# EAGLE schematic ESP8266 (EAGLE 9.5.2)
COMPANY: ADAFRUIT INDUSTRIES; DRAWN: KTOWN; REV: B
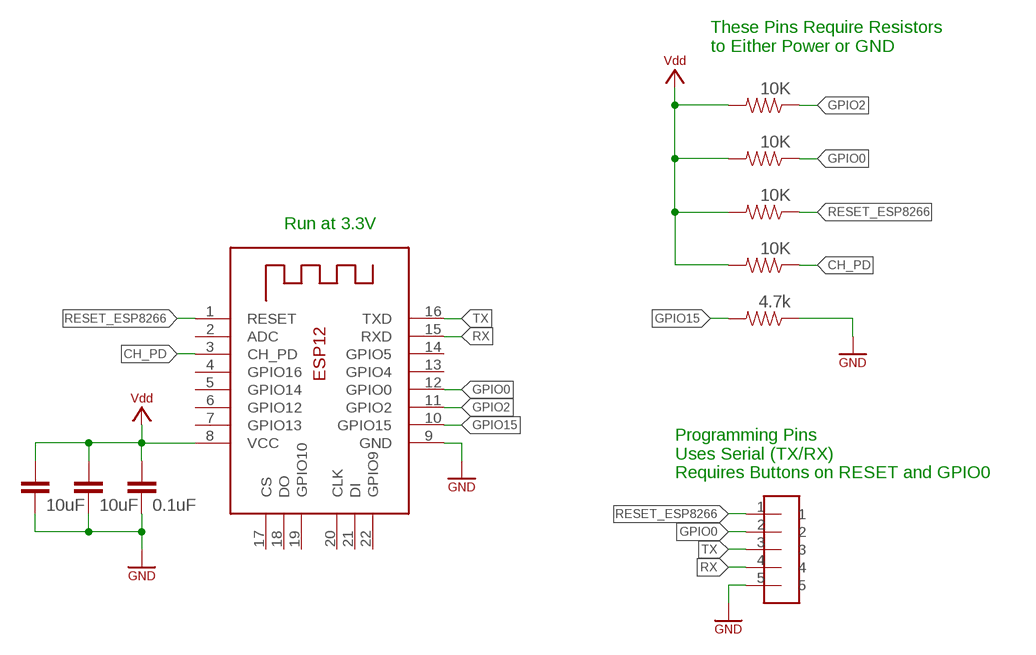
[diagram p0: schematic, sheet 1]

## Parts
C1  0.1uF  COMPONENT_CAP-0805  [0805]
C2  10uF  COMPONENT_CAP-0805  [0805]
C3  10uF  COMPONENT_CAP-0805  [0805]
R1  10K  COMPONENT_RESISTOR-0805  [0805]
R2  10K  COMPONENT_RESISTOR-0805  [0805]
R3  10K  COMPONENT_RESISTOR-0805  [0805]
R4  10K  COMPONENT_RESISTOR-0805  [0805]
R5  4.7k  COMPONENT_RESISTOR-0805  [0805]
U$1  HEADER-5-TESTPOINT  [TESTPOINT-5]
X1  MICRO_ESP8266  [ESP-12E]

## Nets
CH_PD: R4.1 X1.3(CH_PD)
GND: C1.2 C2.2 C3.2 R5.1 U$1.5 X1.9(GND) ; supply symbol labelled SYMBOL_GND
GPIO0: R2.1 U$1.2 X1.12(GPIO0)
GPIO2: R1.1 X1.11(GPIO2)
GPIO15: R5.2 X1.10(GPIO15)
RESET_ESP8266: R3.1 U$1.1 X1.1(RESET)
RX: U$1.4 X1.15(RXD)
TX: U$1.3 X1.16(TXD)
VDD: C1.1 C2.1 C3.1 R1.2 R2.2 R3.2 R4.2 X1.8(VCC) ; supply symbol labelled SYMBOL_VDD
Unconnected: X1.2(ADC) X1.4(GPIO16) X1.5(GPIO14) X1.6(GPIO12) X1.7(GPIO13) X1.13(GPIO4) X1.14(GPIO5) X1.17(CS) X1.18(DO) X1.19(GPIO10) X1.20(CLK) X1.21(DI) X1.22(GPIO9)

## Notes on the sheet
- These Pins Require Resistors
  to Either Power or GND
- Run at 3.3V
- Programming Pins
  Uses Serial (TX/RX)
  Requires Buttons on RESET and GPIO0

## Library data of the parts
C1-C3 = homemade-hardware:COMPONENT_CAP: Capacitor Standard 0603 ceramic capacitor, and 0.1" leaded capacitor.
R1-R5 = homemade-hardware:COMPONENT_RESISTOR
U$1 = homemade-hardware:HEADER-5: NPTC081KFXC-RC <https://www.digikey.com/product-detail/en/sullins-connector-solutions/NPTC081KFXC-RC/S5600-ND/776058>: Vertical Female SMD Headers TSM-110-01-T-SV <https://www.digikey.com/product-detail/en/samtec-inc/TSM-110-01-T-SV/SAM12267-ND/6691889>: Vertical Male SMD Headers M20-8890845 <https://www.digikey.com/products/en?keywords=952-3236-ND>: Horizontal Male SMD Headers M20-7910842R <https://www.digikey.com/product-detail/en/harwin-inc/M20-7910842R/952-3200-6-ND/6559341>: Horizontal Female SMD Headers
X1 = homemade-hardware:MICRO_ESP8266: ESP-12 Module <https://www.digikey.com/products/en/rf-if-and-rfid/rf-transceiver-modules/872?k=esp-12>: Contains ESP8266 WiFi microcontroller (from Adafruit Huzzah)